# Altium project PCB_Project.PrjPcb
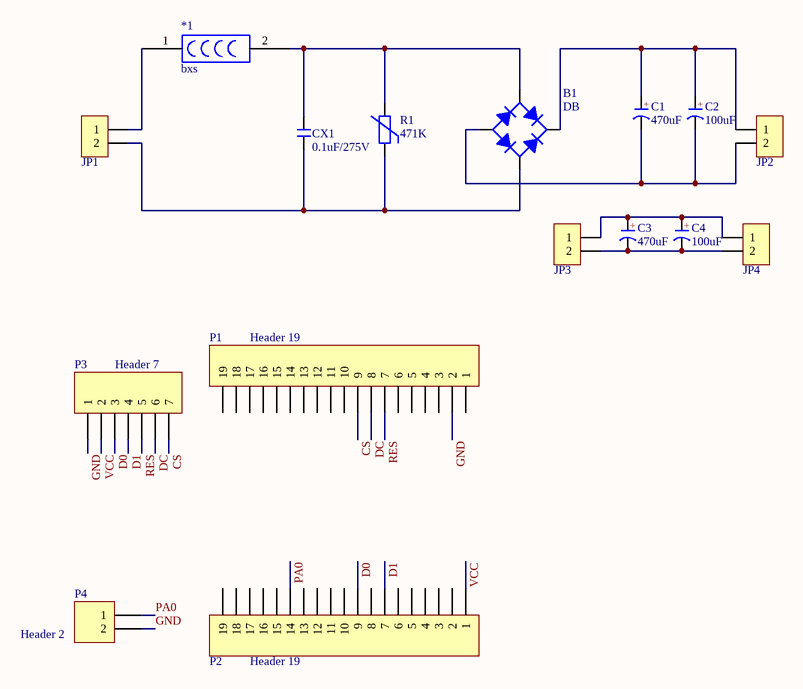
[diagram p0: Sheet1.SchDoc]
1 sheet, 16 parts. Net scope: global (net labels, ports and power ports of the same name join across sheets).
Board file: PCB1.PcbDoc

## Sheet Sheet1.SchDoc
size A4; SheetNumber: 1; SheetTotal: 1

### Parts
*1  bxs  [bxs]
B1  DB  [GBU]
C1  470uF  [CAP 3.5*8*11.5]
C2  100uF  [CAP 3.5*8*11.5]
C3  470uF  [CAP 3.5*8*11.5]
C4  100uF  [CAP 3.5*8*11.5]
CX1  0.1uF/275V  [CX 10*13*11]
JP1  HDR-1X2  [KF2EDGK5.0-LI-2P]  (value not drawn)
JP2  HDR-1X2  [KF2EDGK5.0-LI-2P]  (value not drawn)
JP3  HDR-1X2  [KF2EDGK5.0-LI-2P]  (value not drawn)
JP4  HDR-1X2  [KF2EDGK5.0-LI-2P]  (value not drawn)
P1  Header 19  [HDR1X19]
P2  Header 19  [HDR1X19]
P3  Header 7  [HDR1X7]
P4  Header 2  [HDR1X2]
R1  471K  [VDR 9D-4.5]

### Nets
CS: P1.9 P3.7
D0: P2.9 P3.3
D1: P2.7 P3.4
DC: P1.8 P3.6
GND: P1.2 P3.1 P4.2
PA0: P2.14 P4.1
RES: P1.7 P3.5
VCC: P2.1 P3.2
Net*1_1: *1.1 JP1.1
Net*1_2: *1.2 B1.AC1 CX1.2 R1.2
NetB1_AC2: B1.AC2 CX1.1 JP1.2 R1.1
NetB1_DC+: B1.DC+ C1.1(A) C2.1(A) JP2.1
NetB1_DC-: B1.DC- C1.2(K) C2.2(K) JP2.2
NetC3_1: C3.1(A) C4.1(A) JP3.1 JP4.1
NetC3_2: C3.2(K) C4.2(K) JP3.2 JP4.2

Not connected (* = marked no-connect by the designer): P1 1 3 4 5 6 10 11 12 13 14 15 16 17 18 19; P2 2 3 4 5 6 8 10 11 12 13 15 16 17 18 19

### Notes on the sheet
- (in symbol CE) +

### Library data of the parts
B1 = DB: 整流桥; 淘宝ID: 小糖豆的小窝窝; BOM名称: 整流桥; 下单链接: https://item.taobao.com/item.htm?ft=t&id=613637044352
C1-C4 = CE: 直插电解电容; 淘宝ID: 小糖豆的小窝窝; BOM名称: 直插电解电容; 下单链接: https://item.taobao.com/item.htm?ft=t&id=613637044352
CX1 = CX: 安规X电容; 淘宝ID: 小糖豆的小窝窝; BOM名称: 安规X电容; 下单链接: https://item.taobao.com/item.htm?ft=t&id=613637044352
JP1-JP4 = Header 2: 2P接插件; 淘宝ID: 小糖豆的小窝窝; BOM名称: 2P接插件; 下单链接: https://item.taobao.com/item.htm?ft=t&id=613637044352
P1 P2 = Header 19: Header, 19-Pin; LatestRevisionDate: 17-Jul-2002; LatestRevisionNote: Re-released for DXP Platform.; Publisher: Altium Limited
P3 = Header 7: Header, 7-Pin; LatestRevisionDate: 17-Jul-2002; LatestRevisionNote: Re-released for DXP Platform.; Publisher: Altium Limited
P4 = Header 2: Header, 2-Pin; LatestRevisionDate: 17-Jul-2002; LatestRevisionNote: Re-released for DXP Platform.; Publisher: Altium Limited
R1 = R_VSR: 压敏电阻; 淘宝ID: 小糖豆的小窝窝; BOM名称: 压敏电阻; 下单链接: https://item.taobao.com/item.htm?ft=t&id=613637044352